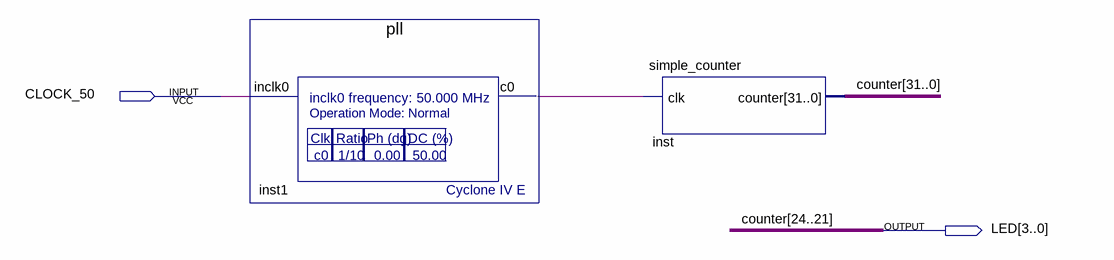
[diagram p0: schematic sheet]
// Quartus schematic CounterTest.bdf as structural Verilog: 2 symbols, 2 pins
module CounterTest (
  input  CLOCK_50,
  output [3:0] LED
);

  wire inst1_c0;
  wire [31:0] counter;

  pll inst1 (.inclk0(CLOCK_50), .c0(inst1_c0));
  simple_counter inst (.clk(inst1_c0), .counter({counter[31:25], LED, counter[20:0]}));

  // Other names for the same wires on the sheet: counter[24:21] = LED
endmodule
